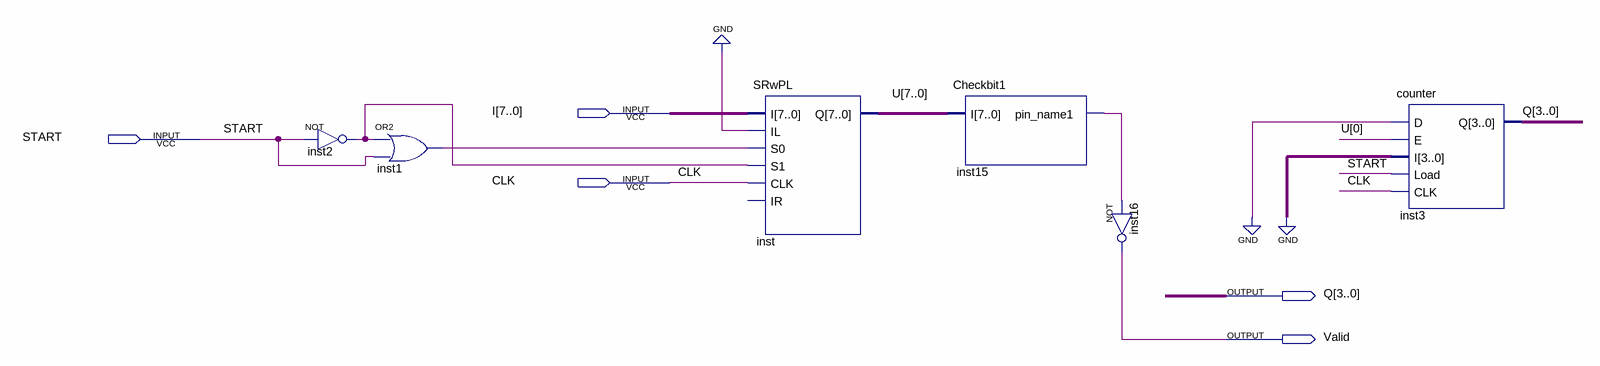
[diagram p0: schematic sheet]
// Quartus schematic Datapath.bdf as structural Verilog: 6 symbols, 5 pins
module Datapath (
  input  [7:0] I,
  input  START,
  input  CLK,
  output [3:0] Q,
  output Valid
);

  wire inst1_out, inst2_out, inst15_pin_name1;
  wire [7:0] U;

  not inst2 (inst2_out, START);
  or inst1 (inst1_out, inst2_out, START);
  SRwPL inst (.I(I), .IL(1'b0), .S0(inst1_out), .S1(inst2_out), .CLK(CLK), .Q(U));  // open: IR
  Checkbit1 inst15 (.I(U), .pin_name1(inst15_pin_name1));
  not inst16 (Valid, inst15_pin_name1);
  counter inst3 (.D(1'b0), .E(U[0]), .I(4'b0000), .Load(START), .CLK(CLK), .Q(Q));
endmodule
